# EAGLE design RoboPad (EAGLE 6.5.0)
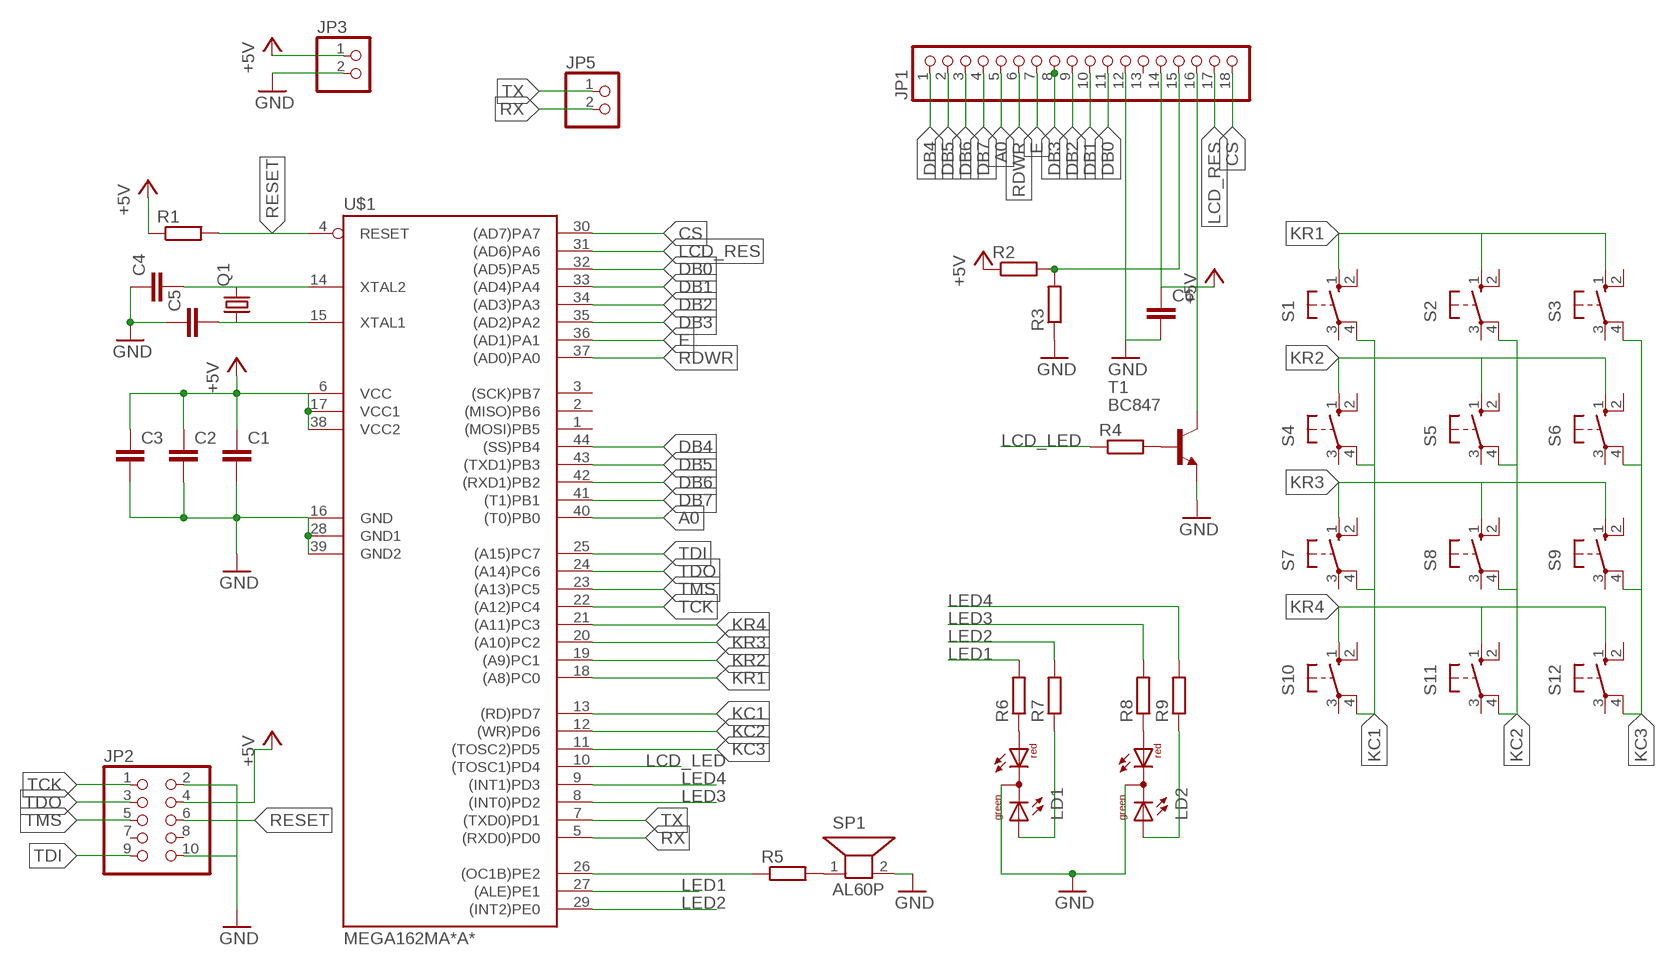
[diagram p0: schematic, sheet 1]

## Parts
C1  C-EUC0805  [C0805]
C2  C-EUC0805  [C0805]
C3  C-EUC0805  [C0805]
C4  C-EUC0805  [C0805]
C5  C-EUC0805  [C0805]
C6  C-EUC0805  [C0805]
JP1  PINHD-1X18  [1X18]
JP2  PINHD-2X5  [2X05]
JP3  PINHD-1X2/90  [1X02/90]
JP5  PINHD-1X2/90  [1X02/90]
LD1  DUOLED-RG-C  [DUOLED-C-5MM]
LD2  DUOLED-RG-C  [DUOLED-C-5MM]
Q1  CRYSTALHC49U-V  [HC49U-V]
R1  R-EU_R0805  [R0805]
R2  R-EU_R0805  [R0805]
R3  R-EU_R0805  [R0805]
R4  R-EU_R0805  [R0805]
R5  R-EU_R0805  [R0805]
R6  R-EU_R0805  [R0805]
R7  R-EU_R0805  [R0805]
R8  R-EU_R0805  [R0805]
R9  R-EU_R0805  [R0805]
S1  10-XX  [B3F-10XX]
S2  10-XX  [B3F-10XX]
S3  10-XX  [B3F-10XX]
S4  10-XX  [B3F-10XX]
S5  10-XX  [B3F-10XX]
S6  10-XX  [B3F-10XX]
S7  10-XX  [B3F-10XX]
S8  10-XX  [B3F-10XX]
S9  10-XX  [B3F-10XX]
S10  10-XX  [B3F-10XX]
S11  10-XX  [B3F-10XX]
S12  10-XX  [B3F-10XX]
SP1  AL60P  [AL60P]
T1  BC847  [SOT23]
U$1  MEGA162MA*A*  [TQFP44]

## Nets
+5V: C1.1 C2.1 C3.1 C6.1 JP1.14 JP2.4 JP3.1 R1.1 R2.1 U$1.6(VCC) U$1.17(VCC1) U$1.38(VCC2)
A0: JP1.5 U$1.40((T0)PB0)
CS: JP1.18 U$1.30((AD7)PA7)
DB0: JP1.11 U$1.32((AD5)PA5)
DB1: JP1.10 U$1.33((AD4)PA4)
DB2: JP1.9 U$1.34((AD3)PA3)
DB3: JP1.8 U$1.35((AD2)PA2)
DB4: JP1.1 U$1.44((SS)PB4)
DB5: JP1.2 U$1.43((TXD1)PB3)
DB6: JP1.3 U$1.42((RXD1)PB2)
DB7: JP1.4 U$1.41((T1)PB1)
E: JP1.7 U$1.36((AD1)PA1)
GND: C1.2 C2.2 C3.2 C4.1 C5.1 C6.2 JP1.12 JP2.2 JP2.10 JP3.2 LD1.C LD2.C R3.1 SP1.2 T1.2(E) U$1.16(GND) U$1.28(GND1) U$1.39(GND2)
KC1: S1.4(P1) S4.4(P1) S7.4(P1) S10.4(P1) U$1.13((RD)PD7)
KC2: S2.4(P1) S5.4(P1) S8.4(P1) S11.4(P1) U$1.12((WR)PD6)
KC3: S3.4(P1) S6.4(P1) S9.4(P1) S12.4(P1) U$1.11((TOSC2)PD5)
KR1: S1.1(S) S2.1(S) S3.1(S) U$1.18((A8)PC0)
KR2: S4.1(S) S5.1(S) S6.1(S) U$1.19((A9)PC1)
KR3: S7.1(S) S8.1(S) S9.1(S) U$1.20((A10)PC2)
KR4: S10.1(S) S11.1(S) S12.1(S) U$1.21((A11)PC3)
LCD_LED: R4.1 U$1.10((TOSC1)PD4)
LCD_RES: JP1.17 U$1.31((AD6)PA6)
LED1: R6.2 U$1.27((ALE)PE1)
LED2: R7.2 U$1.29((INT2)PE0)
LED3: R8.2 U$1.8((INT0)PD2)
LED4: R9.2 U$1.9((INT1)PD3)
N$1: C4.2 Q1.2 U$1.14(XTAL2)
N$2: C5.2 Q1.1 U$1.15(XTAL1)
N$3: JP1.16 T1.3(C)
N$4: JP1.15 R2.2 R3.2
N$5: R5.1 U$1.26((OC1B)PE2)
N$6: R5.2 SP1.1
N$9: R4.2 T1.1(B)
N$10: LD1.AR R6.1
N$11: LD2.AR R8.1
N$12: LD1.AX(AG) R7.1
N$16: LD2.AX(AG) R9.1
RDWR: JP1.6 U$1.37((AD0)PA0)
RESET: JP2.6 R1.2 U$1.4(RESET)
RX: JP5.2 U$1.5((RXD0)PD0)
TCK: JP2.1 U$1.22((A12)PC4)
TDI: JP2.9 U$1.25((A15)PC7)
TDO: JP2.3 U$1.24((A14)PC6)
TMS: JP2.5 U$1.23((A13)PC5)
TX: JP5.1 U$1.7((TXD0)PD1)
Unconnected: JP1.13 JP2.7 JP2.8 S1.2(S1) S1.3(P) S2.2(S1) S2.3(P) S3.2(S1) S3.3(P) S4.2(S1) S4.3(P) S5.2(S1) S5.3(P) S6.2(S1) S6.3(P) S7.2(S1) S7.3(P) S8.2(S1) S8.3(P) S9.2(S1) S9.3(P) S10.2(S1) S10.3(P) S11.2(S1) S11.3(P) S12.2(S1) S12.3(P) U$1.1((MOSI)PB5) U$1.2((MISO)PB6) U$1.3((SCK)PB7)

## Library data of the parts
C1-C6 = rcl:C-EU: CAPACITOR, European symbol
JP1 = pinhead:PINHD-1X18: PIN HEADER
JP2 = pinhead:PINHD-2X5: PIN HEADER
JP3 JP5 = pinhead:PINHD-1X2: PIN HEADER
LD1 LD2 = led:DUOLED-RG-C: DUO LED 2 colors (red/green), 5 mm, round, common Cathode www.ligitek.com or other producers.
Q1 = crystal:CRYSTAL: CRYSTAL; OC_FARNELL: 1666969; OC_NEWARK: unknown
R1-R9 = rcl:R-EU_: RESISTOR, European symbol
S1-S12 = switch-omron:10-XX: OMRON SWITCH; MPN: B3F-1000; OC_FARNELL: 176432; OC_NEWARK: 36M3542
SP1 = buzzer:AL60P: SPEAKER Source: Buerklin; OC_FARNELL: unknown; OC_NEWARK: unknown
T1 = transistor:BC847: NPN TRANSISTOR
U$1 = avr-6:MEGA162*MA: Atmel Mega162 TQFP and MLF packages

## Board
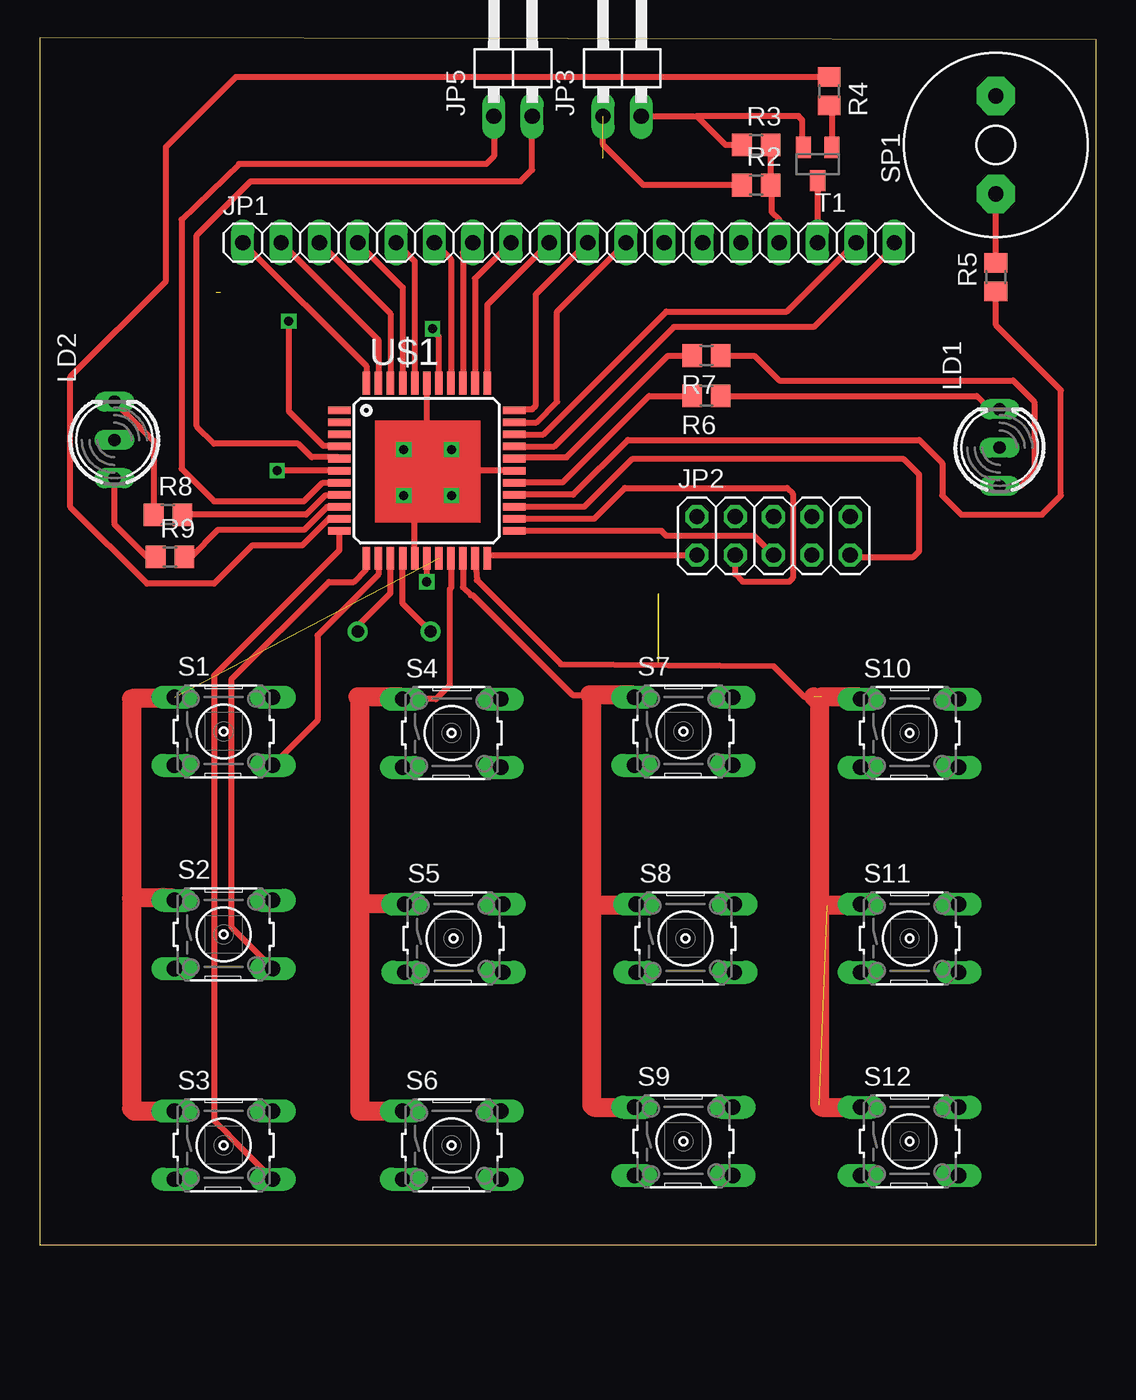
[diagram p1: board, top side]
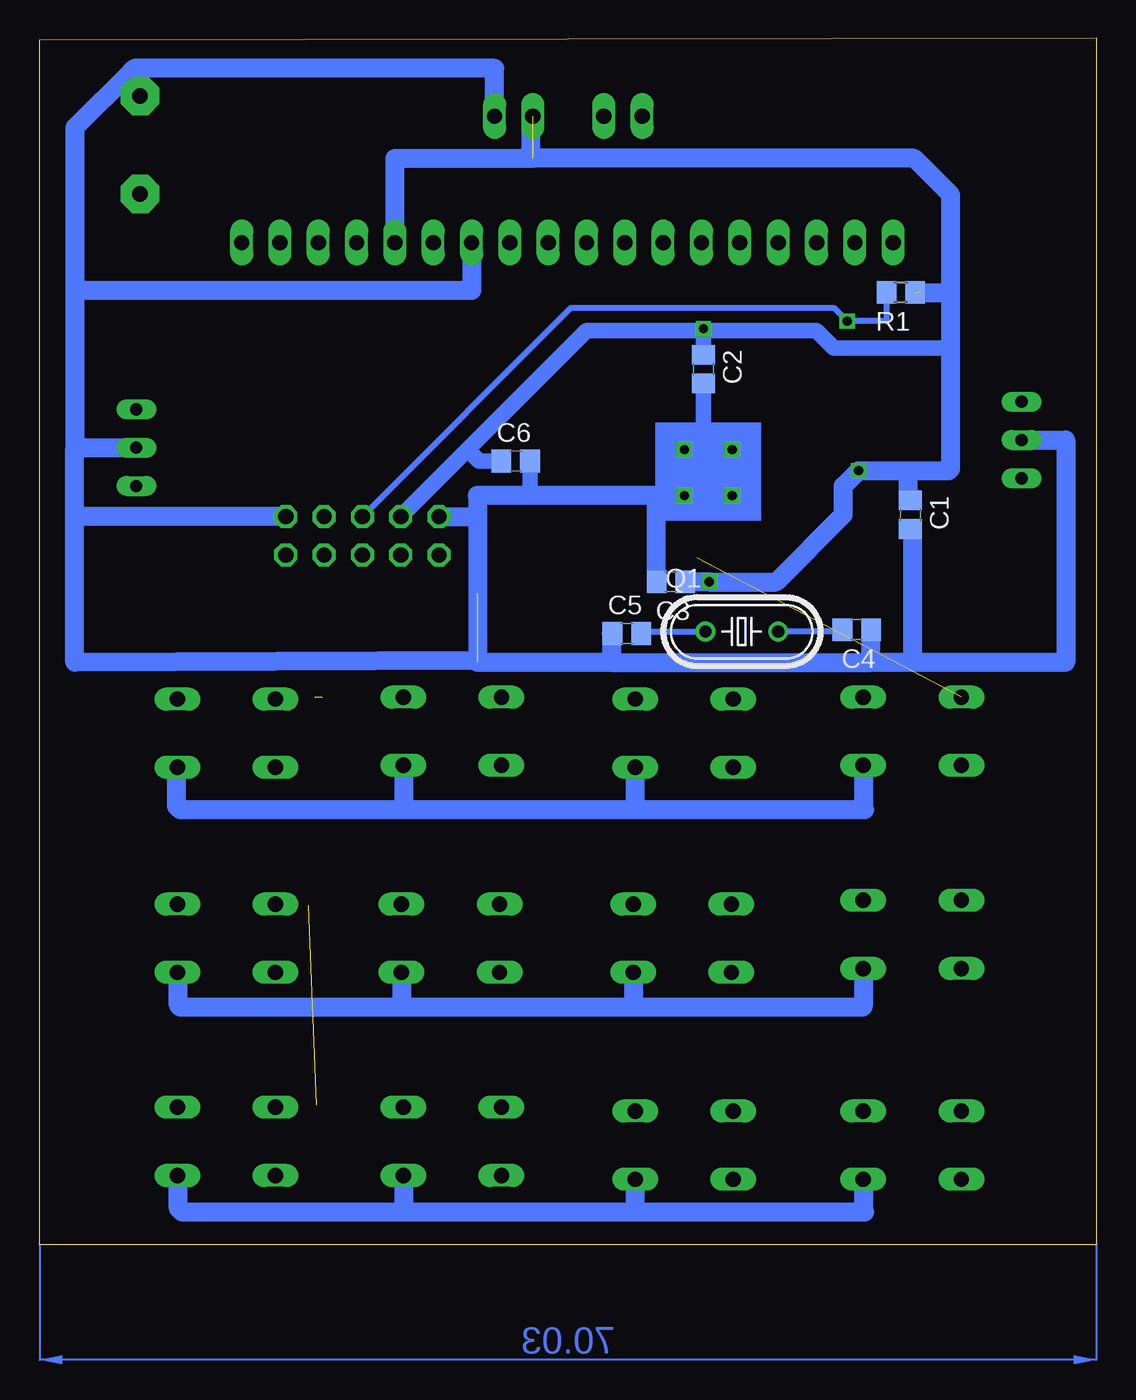
[diagram p2: board, bottom side, seen from below]

Size 70.03 x 80 mm. Coordinates in mm from the lower left corner, seen from the top.
Outline: 0,0 70.03,0 70.03,79.87 0,80 0,0
Copper layers (1*16): Top 0.035mm / dielectric 1.5mm / Bottom 0.035mm
Design rules "default": minimum track width 10mil, minimum drill 24mil, track to track 8mil, track to pad 8mil, pad to pad 8mil, via to via 8mil, smd to smd 8mil, copper to edge 40mil, drill to drill 8mil, minimum pad ring 10mil, minimum via ring 8mil, stop-mask expansion 4mil, vias tented up to drill 0mil, thermal gap 10mil

### Footprints (pad centres in the part's own frame; a part is rotated, then mirrored left to right if it is on the bottom)
C0805 = smd 1.3 x 1.5: 1 -0.95,0; 2 0.95,0
1X18 = drill 1.016 long: 1 -21.59,0; 2 -19.05,0; 3 -16.51,0; 4 -13.97,0; 5 -11.43,0; 6 -8.89,0; 7 -6.35,0; 8 -3.81,0; 9 -1.27,0; 10 1.27,0; 11 3.81,0; 12 6.35,0; 13 8.89,0; 14 11.43,0; 15 13.97,0; 16 16.51,0; 17 19.05,0; 18 21.59,0
2X05 = drill 1.016 octagon: 1 -5.08,-1.27; 2 -5.08,1.27; 3 -2.54,-1.27; 4 -2.54,1.27; 5 0,-1.27; 6 0,1.27; 7 2.54,-1.27; 8 2.54,1.27; 9 5.08,-1.27; 10 5.08,1.27
1X02/90 = drill 1.016 long: 1 -1.27,-3.81; 2 1.27,-3.81
DUOLED-C-5MM = drill 0.813 long: AR 2.54,0; AX -2.54,0; C 0,0
HC49U-V = drill 0.813: 1 -2.413,0; 2 2.413,0
R0805 = smd 1.3 x 1.5: 1 -0.95,0; 2 0.95,0
B3F-10XX = drill 1.016 long: 1 -3.251,2.261; 2 3.251,2.261; 3 -3.251,-2.261; 4 3.251,-2.261
AL60P = drill 1.016 pad 2.54 octagon: 1 -3.251,0; 2 3.251,0
SOT23 = smd 1 x 1.4: 1 -0.95,-1.1; 2 0.95,-1.1; 3 0,1.1
TQFP44 = smd 1.5 x 0.5: 1 -5.8,4; 2 -5.8,3.2; 3 -5.8,2.4; 4 -5.8,1.6; 5 -5.8,0.8; 6 -5.8,0; 7 -5.8,-0.8; 8 -5.8,-1.6; 9 -5.8,-2.4; 10 -5.8,-3.2; 11 -5.8,-4; 23 5.8,-4; 24 5.8,-3.2; 25 5.8,-2.4; 26 5.8,-1.6; 27 5.8,-0.8; 28 5.8,0; 29 5.8,0.8; 30 5.8,1.6; 31 5.8,2.4; 32 5.8,3.2; 33 5.8,4 | smd 0.5 x 1.5: 12 -4,-5.8; 13 -3.2,-5.8; 14 -2.4,-5.8; 15 -1.6,-5.8; 16 -0.8,-5.8; 17 0,-5.8; 18 0.8,-5.8; 19 1.6,-5.8; 20 2.4,-5.8; 21 3.2,-5.8; 22 4,-5.8; 34 4,5.8; 35 3.2,5.8; 36 2.4,5.8; 37 1.6,5.8; 38 0.8,5.8; 39 0,5.8; 40 -0.8,5.8; 41 -1.6,5.8; 42 -2.4,5.8; 43 -3.2,5.8; 44 -4,5.8

### Placement (x,y rotation side)
C1  12.32,48.39 270 bottom
C2  26.04,58.04 270 bottom
C3  28.19,43.94 180 bottom
C4  15.88,40.77 180 bottom
C5  31.11,40.51 0 bottom
C6  38.48,51.94 0 bottom
JP1  35.05,66.42 0 top
JP2  48.64,46.99 0 top
JP3  38.61,78.61 0 top
JP5  31.37,78.61 0 top
LD1  63.63,52.83 90 top
LD2  4.95,53.34 90 top
Q1  23.5,40.64 0 bottom
R1  12.95,63.12 180 bottom
R2  47.5,70.23 0 top
R3  47.5,72.9 0 top
R4  52.32,76.45 270 top
R5  63.37,64.14 90 top
R6  44.2,56.26 180 top
R7  44.2,58.93 180 top
R8  8.51,48.39 0 top
R9  8.64,45.59 0 top
S1  12.19,34.04 0 top
S2  12.19,20.57 0 top
S3  12.19,6.6 0 top
S4  27.3,33.91 0 top
S5  27.43,20.32 0 top
S6  27.3,6.6 0 top
S7  42.67,34.04 0 top
S8  42.8,20.32 0 top
S9  42.67,6.86 0 top
S10  57.66,33.91 0 top
S11  57.66,20.32 0 top
S12  57.66,6.86 0 top
SP1  63.37,72.9 90 top
T1  51.56,71.63 180 top
U$1  25.65,51.31 0 top

### Tracks (layer width: path | path; a pad name or v marks a point on that pad's centre or on a via)
+5V  (via drill 0.6)  (3 unrouted)
  Top 0.406: 26.42,57.15 U$1.38 26.45,60.16 26.04,60.58 | U$1.6 v15.75,51.31 | U$1.17 v25.65,43.94 | R2.1 40.01,70.23 37.34,72.9 JP3.1
  Bottom 1.016: 26.04,60.58 C2.1 | 26.04,60.58 18.54,60.58 17.4,59.44 9.65,59.44 | 26.04,60.58 33.78,60.58 41.66,52.7 | 41.66,52.7 JP2.4 | C6.1 40.89,51.94 41.66,52.7
  Bottom 1.27: 37.34,72.01 12.06,72.01 9.65,69.6 9.65,63.12 | 12.45,51.31 v15.75,51.31 16.76,50.29 16.76,48.39 21.21,43.94 v25.65,43.94 C3.1 | 12.45,51.31 9.78,51.31 9.65,51.44 9.65,59.44 9.65,63.12 | 11.68,63.12 9.65,63.12 | C1.1 12.45,49.46 12.45,51.31 | JP1.14 46.48,72.01 37.47,72.01 37.47,74.8 JP3.1
A0
  Top 0.406: JP1.5 24.85,65.19 U$1.40
CS
  Top 0.406: JP1.18 56.64,66.17 51.31,60.83 42.04,60.83 34.11,52.91 U$1.30
DB0
  Top 0.406: U$1.32 32.92,54.51 34.29,55.88 34.29,61.85 JP1.11
DB1
  Top 0.406: U$1.33 31.52,55.37 32.64,55.37 32.89,55.63 32.89,62.99 JP1.10
DB2
  Top 0.406: JP1.9 29.65,62.29 U$1.34
DB3
  Top 0.406: JP1.8 28.85,64.03 U$1.35
DB4
  Top 0.406: JP1.1 21.65,58.23 U$1.44
DB5
  Top 0.406: JP1.2 22.45,59.97 U$1.43
DB6
  Top 0.406: JP1.3 23.25,61.71 U$1.42
DB7
  Top 0.406: JP1.4 24.05,63.45 U$1.41
E
  Top 0.406: JP1.7 28.05,65.77 U$1.36
GND  (via drill 0.6)  (2 unrouted)
  Top 0.406: U$1.39 25.65,52.07 | 25.65,52.07 25.65,51.82 24.85,51.02 | 24.85,51.02 24.77,50.93 | U$1.16 24.85,51.02 | U$1.28 26.42,51.31 25.65,52.07 | JP3.2 43.56,74.8 | 43.56,74.8 45.47,72.9 R3.1 | T1.2 50.55,72.79 50.55,74.55 50.29,74.8 43.56,74.8
  Top 1.27: 25.65,52.07 25.65,52.7 v27.3,52.7
  Bottom 0.406: C4.1 14.99,40.71 | C5.1 31.88,40.33
  Bottom 1.016: C2.2 26.04,53.98 v27.3,52.7 | C6.2 37.53,49.72 37.59,49.66
  Bottom 1.27: JP3.2 39.88,77.98 63.75,77.98 63.94,77.79 | 63.94,77.79 67.69,74.04 67.69,63.25 | 67.69,63.25 67.69,52.83 | 67.69,52.83 LD1.C | SP1.2 63.94,76.72 63.94,77.79 | JP2.10 67.69,48.26 | 67.69,48.26 67.69,52.83 | JP2.2 41.27,48.26 41.02,48.01 | 41.02,48.01 41.02,38.73 | 41.02,38.73 41.02,38.61 32.13,38.61 | 41.02,38.73 67.69,38.61 67.69,48.26 | 29.34,49.66 v27.3,49.66 v27.3,52.7 v24.13,52.7 | 29.34,49.66 37.59,49.66 41.02,49.66 41.02,48.01 | C5.1 32.13,40.51 32.13,38.61 | 32.13,38.61 14.93,38.61 | 14.93,38.61 C4.1 | LD2.C 2.03,53.34 2.03,38.61 12.19,38.61 | 12.19,38.61 14.93,38.61 | C1.2 12.19,47.31 12.19,38.61 | 24,52.7 v24.13,52.7 | v24.13,52.7 v24.13,49.66 | C3.2 29.14,49.46 29.34,49.66 | JP1.12 41.4,63.25 67.69,63.25
KC1
  Top 0.406: U$1.13 22.45,44.42 18.41,40.39 18.41,34.75 S1.4
  Bottom 1.27: S1.4 15.44,28.91 15.37,28.83 30.86,28.83 | 30.86,28.83 45.47,28.83 | 45.47,28.83 60.71,28.83 60.96,29.08 60.96,31.6 S10.4 | S4.4 30.56,29.13 30.86,28.83 | S7.4 45.92,29.29 45.47,28.83
KC2
  Top 0.406: U$1.12 21.63,44.75 20.83,43.94 19.18,43.94 12.7,37.47 12.7,21.06 S2.4
  Bottom 1.27: S2.4 15.44,15.8 15.49,15.75 30.73,15.75 | 30.73,15.75 45.97,15.75 | 45.97,15.75 60.71,15.75 60.83,15.88 60.83,17.98 S11.4 | S8.4 46.05,15.82 45.97,15.75 | S5.4 30.68,15.8 30.73,15.75
KC3
  Top 0.406: U$1.11 19.85,46.02 11.56,37.72 11.56,8.23 12.45,7.34 12.69,7.1 S3.4
  Bottom 1.27: S3.4 15.44,2.23 15.37,2.16 30.61,2.16 | 30.61,2.16 45.47,2.16 | 45.47,2.16 60.58,2.16 60.83,2.41 60.83,4.52 S12.4 | S9.4 45.92,2.62 45.47,2.16 | S6.4 30.56,2.21 30.61,2.16
KR1  (1 unrouted)
  Top 1.27: S1.1 8.84,36.2 6.1,36.2 6.1,22.99 | 6.1,22.99 6.1,9.02 6.25,8.87 S3.1 | S2.1 8.79,22.99 6.1,22.99
KR2
  Top 0.406: U$1.19 27.25,43.51 27.18,43.43 27.18,37.08 26.26,36.17 S4.1 | 21.46,36.58 21.21,36.32
  Top 1.27: S4.1 23.9,36.32 21.21,36.32 21.08,36.32 21.21,36.2 21.21,22.61 | 21.21,22.61 21.21,8.89 21.23,8.87 S6.1 | S5.1 24.18,22.61 21.21,22.61
KR3
  Top 0.406: U$1.20 28.05,43.57 28.57,43.05 28.7,43.05 35.31,36.45 36.45,36.45
  Top 1.27: S7.1 39.27,36.45 36.45,36.45 36.58,36.32 36.58,22.48 | 36.58,22.48 36.58,9.27 36.73,9.12 S9.1 | S8.1 39.55,22.48 36.58,22.48
KR4  (2 unrouted)
  Top 0.406: U$1.21 28.98,44.04 34.54,38.48 48.64,38.35 50.67,36.32 51.82,36.32
  Top 1.27: S10.1 54.25,36.32 51.82,36.32 | 51.31,36.32 51.69,35.94 51.69,9.27 51.84,9.12 S12.1 | S11.1 54.3,22.48 52.2,22.48
LCD_LED
  Top 0.406: U$1.10 19.83,48.13 19.18,48.13 17.4,46.35 14.1,46.35 11.56,43.81 7.11,43.81 2.03,48.9 2.03,57.53 8.38,63.88 8.38,72.77 13.02,77.4 R4.1
LCD_RES
  Top 0.406: U$1.31 33.39,53.71 41.53,61.85 49.53,61.85 JP1.17
LED1
  Top 0.406: U$1.27 31.49,50.55 34.67,50.55 40.39,56.26 R6.2
LED2
  Top 0.406: U$1.29 31.54,52.2 34.92,52.2 41.66,58.93 R7.2
LED3
  Top 0.406: U$1.8 19.8,49.66 18.92,49.66 17.65,48.39 R8.2
LED4
  Top 0.406: U$1.9 19.84,48.9 19.05,48.9 17.53,47.37 11.81,47.37 10.03,45.59 R9.2
N$1
  Top 0.406: Q1.2 21.08,41.02 23.25,43.19 U$1.14
  Bottom 0.406: C4.2 16.95,40.64 Q1.2
N$2
  Top 0.406: Q1.1 24.05,42.49 U$1.15
  Bottom 0.406: C5.2 30.04,40.64 Q1.1
N$3
  Top 0.406: T1.3 JP1.16
N$4
  Top 0.406: R3.2 R2.2 48.51,70.17 48.51,68.45 49.02,67.94 JP1.15
N$5
  Top 0.406: 31.5,49.66 U$1.26 35.36,49.71 38.99,53.34 58.29,53.34 59.82,51.82 59.82,49.66 61.09,48.39 66.42,48.39 67.69,49.66 67.69,56.64 63.37,60.96 R5.1
N$6
  Top 0.406: R5.2 SP1.1
N$7  (via drill 0.6)
  other vias: 26.04,60.71
N$9
  Top 0.406: R4.2 52.51,75.32 T1.1
N$10
  Top 0.406: R6.1 62.1,56.26 62.99,55.37 LD1.AR
N$11
  Top 0.406: LD2.AR 7.56,53.27 R8.1
N$12
  Top 0.406: R7.1 47.37,58.93 49.02,57.28 64.52,57.28 65.91,55.88 65.91,51.18 65.02,50.29 LD1.AX
N$16
  Top 0.406: LD2.AX 4.95,47.75 7.11,45.59 R9.1
RDWR
  Top 0.406: JP1.6 27.25,65.33 U$1.37
RESET  (via drill 0.6)
  Top 0.406: v16.51,61.21 16.51,55.24 18.8,52.96 19.8,52.96 U$1.4
  Bottom 0.406: JP2.6 34.8,62.1 17.4,62.1 v16.51,61.21 13.9,61.21 R1.2
RX
  Top 0.406: U$1.5 19.77,52.2 18.03,52.2 17.14,53.09 11.56,53.09 10.41,54.23 10.41,66.93 13.97,70.48 31.88,70.48 32.64,71.25 JP5.2
TCK
  Top 0.406: U$1.22 29.87,45.72 JP2.1
TDI
  Top 0.406: JP2.9 53.85,45.59 57.91,45.59 58.29,45.97 58.29,51.05 57.28,52.07 39.24,52.07 36.08,48.91 U$1.25
TDO
  Top 0.406: U$1.24 36.73,48.11 38.78,50.16 49.53,50.16 49.91,49.78 49.91,44.2 49.66,43.94 46.61,43.94 46.1,44.45 JP2.3
TMS
  Top 0.406: JP2.5 47.37,46.99 41.53,46.99 41.21,47.31 U$1.23
TX
  Top 0.406: JP5.1 30.1,72.14 29.59,71.63 13.21,71.63 9.4,67.94 9.4,51.44 11.56,49.28 17.53,49.28 18.76,50.51 U$1.7
(copper drawn outside any net)
  shapes: Bottom area x2, Top area x1